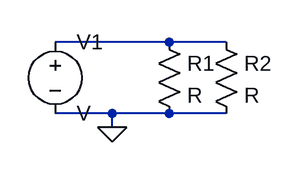
[diagram p0: schematic p3 parallel.asc]
p3 parallel.asc, the LTspice schematic file:
Version 4
SHEET 1 880 680
WIRE 16 192 -112 192
WIRE 80 192 16 192
WIRE -48 272 -112 272
WIRE 16 272 -48 272
WIRE 80 272 16 272
WIRE -48 288 -48 272
FLAG -48 288 0
SYMBOL voltage -112 176 R0
SYMATTR InstName V1
SYMBOL res 0 176 R0
SYMATTR InstName R1
SYMBOL res 64 176 R0
SYMATTR InstName R2

The netlist it stands for:
* p3 parallel.asc
V1 N001 0 V
R1 N001 0 R
R2 N001 0 R
.backanno
.end